# EAGLE design G1Tech PowerRelayMOV_v08 (EAGLE 9.3.1)
CNAME: G1Tech-Power-Relay-MOV; CREVISION: C; DESIGNER: G1Tech
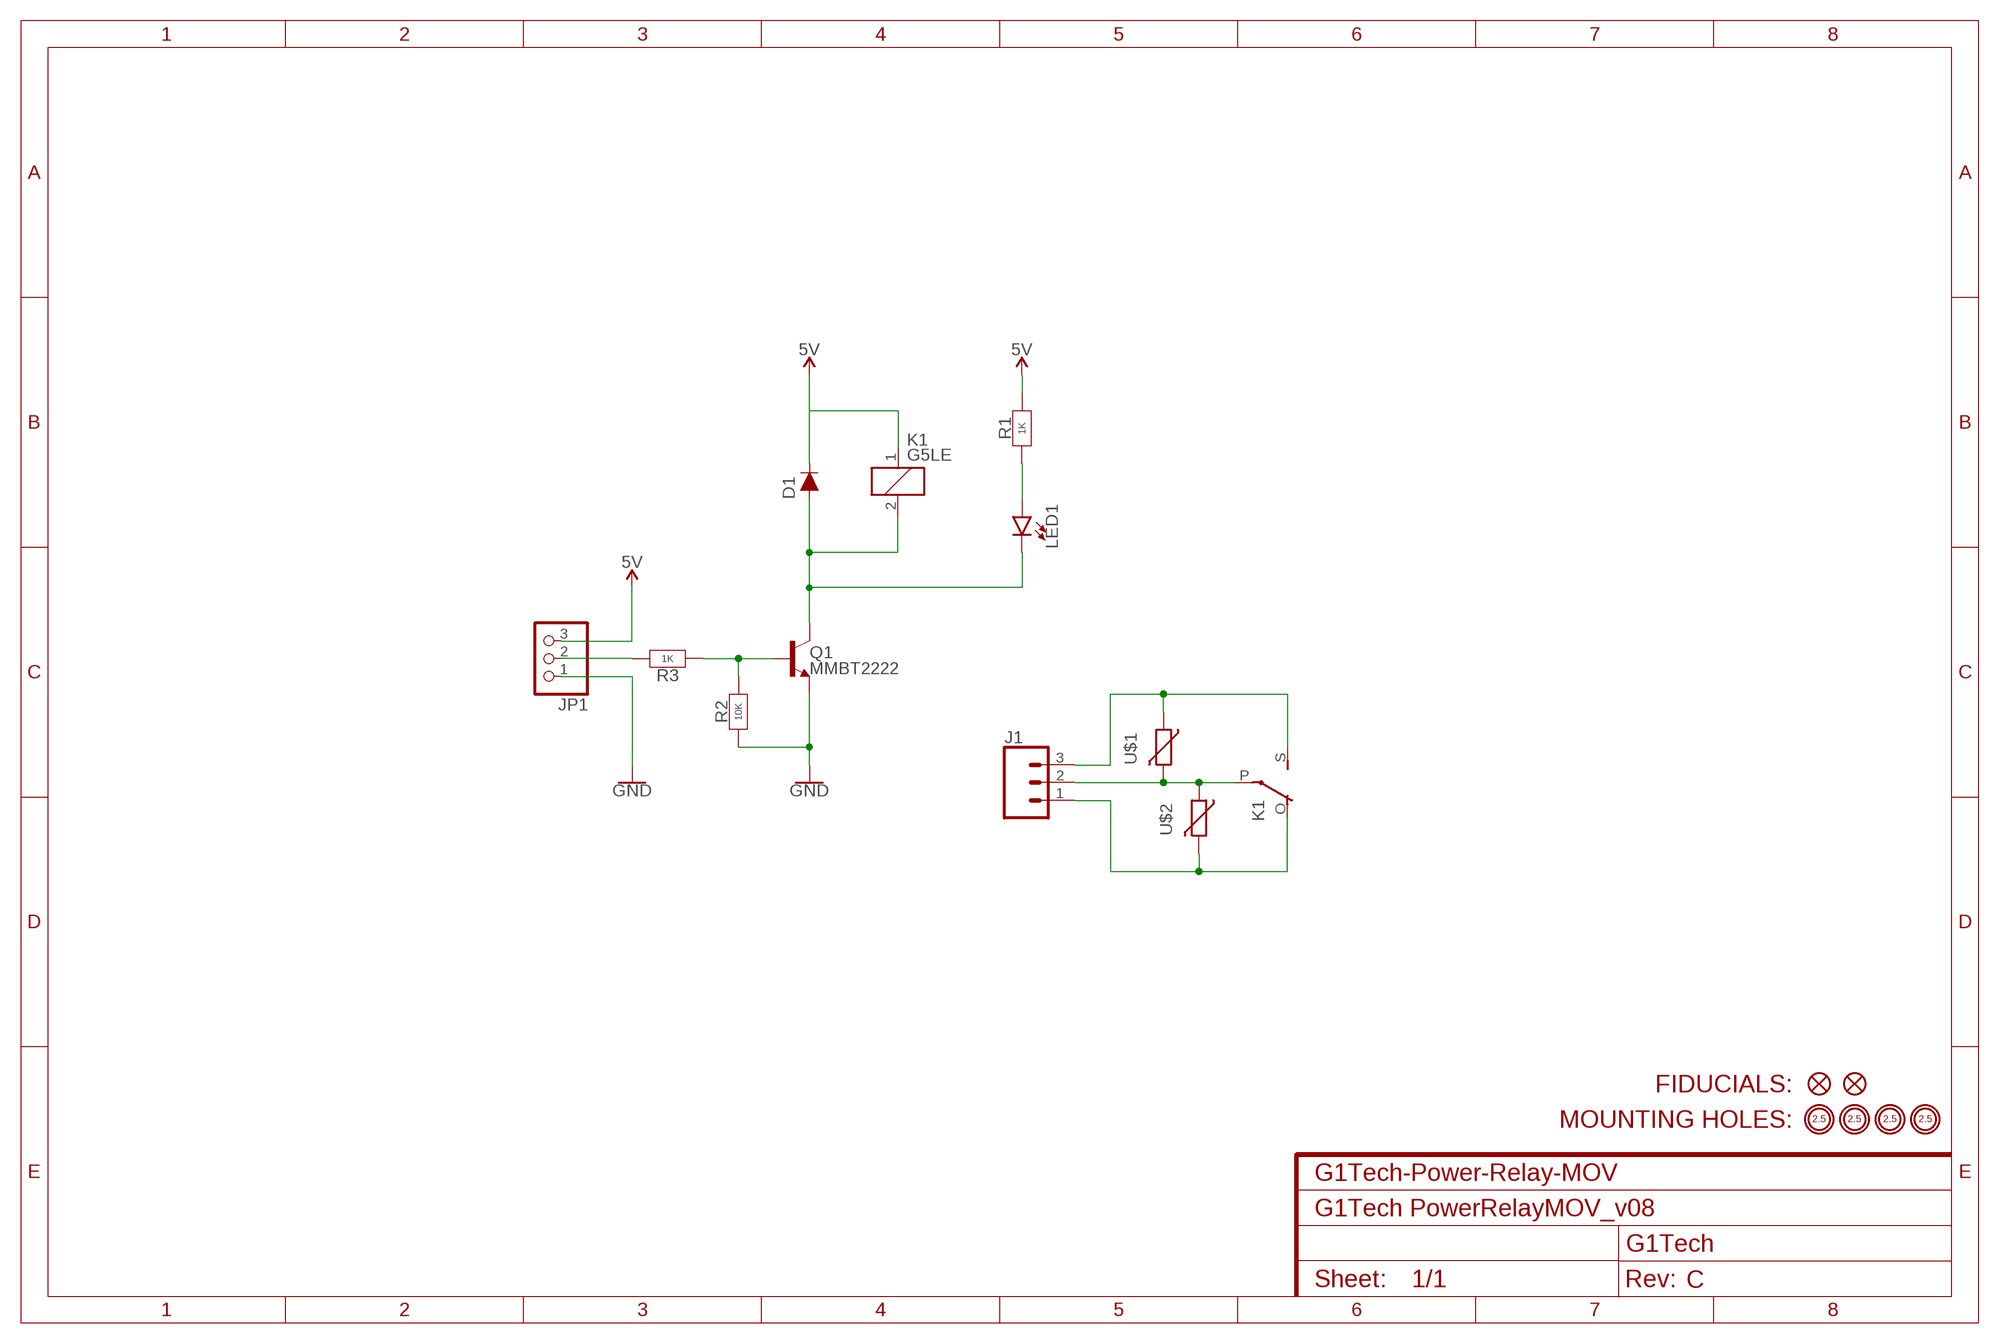
[diagram p0: schematic, sheet 1]

## Parts
D1  DIODE-1N4148W  [SOD123]
FD1  FIDUCIAL-1X2  [FIDUCIAL-1X2]
FD2  FIDUCIAL-1X2  [FIDUCIAL-1X2]
H1  MOUNTINGHOLE-PLATED-2.5  [MOUNTINGHOLE-PLATED-2.5]
H2  MOUNTINGHOLE-PLATED-2.5  [MOUNTINGHOLE-PLATED-2.5]
H3  MOUNTINGHOLE-PLATED-2.5  [MOUNTINGHOLE-PLATED-2.5]
H4  MOUNTINGHOLE-PLATED-2.5  [MOUNTINGHOLE-PLATED-2.5]
J1  CONN_03-SCREW-5MM  [SCREWTERMINAL-5MM-3]
JP1  PINHD-1X3  [1X03]
K1  G5LE  [G5LE]
LED1  LED0805  [LED0805]
Q1  MMBT2222  TRANS-NPN-MMBT2222  [SOT23-3]
R1  1K  YAGEO-R0603  [YAGEO-R0603]
R2  10K  YAGEO-R0603  [YAGEO-R0603]
R3  1K  YAGEO-R0603  [YAGEO-R0603]
U$1  MOV-V250LA4P  [V250LA4P]
U$2  MOV-V250LA4P  [V250LA4P]

## Nets
5V: D1.C JP1.3 K1.1 R1.2
GND: JP1.1 Q1.2(E) R2.1
N$1: D1.A K1.2 LED1.C Q1.3(C)
N$2: LED1.A R1.1
N$3: Q1.1(B) R2.2 R3.1
N$4: JP1.2 R3.2
N$5: J1.2 K1.P(2:P) U$1.P$2 U$2.P$1
N$6: J1.3 K1.S(2:S) U$1.P$1
N$7: J1.1 K1.O(2:O) U$2.P$2

## Library data of the parts
D1 = G1Tech-DiscreteSemi:DIODE-1N4148W
FD1 FD2 = G1Tech-Design:FIDUCIAL-1X2
H1-H4 = G1Tech-Design:MOUNTINGHOLE-PLATED-2.5
J1 = SparkFun-Connectors:CONN_03: Multi connection point. Often used as Generic Header-pin footprint for 0.1 inch spaced/style header connections On any of the 0.1 inch spaced packages, you can populate with these: Break Away Headers - Straight <https://www.sparkfun.com/products/116> (PRT-00116) Break Away Male Headers - Right Angle <https://www.sparkfun.com/products/553> (PRT-00553) Female Headers <https://www.sparkfun.com/products/115> (PRT-00115) Break Away Headers - Machine Pin <https://www.sparkfun.com/products/117> (PRT-00117) Break Away Female Headers - Swiss Machine Pin <https://www.sparkfun.com/products/743> (PRT-00743) Stackable Header - 3 Pin (Female, 0.1") <https://www.sparkfun.com/products/13875> (PRT-13875) For SCREWTERMINALS and SPRING TERMINALS visit here: Screw Terimnals on SparkFun.com <https://www.sparkfun.com/search/results?term=Screw+Terminals> (5mm/3.5mm/2.54mm spacing) This device is also useful as a general connection point to wire up your design to another part of your project. Our various solder wires solder well into these plated through hole pads. Hook-Up Wire - Assortment (Stranded, 22 AWG) <https://www.sparkfun.com/products/11375> (PRT-11375) Hook-Up Wire - Assortment (Solid Core, 22 AWG) <https://www.sparkfun.com/products/11367> (PRT-11367) View the entire wire category on our website here <https://www.sparkfun.com/categories/141> Special notes: Molex polarized connector foot print use with SKU : PRT-08232 with associated crimp pins and housings.; PROD_ID: CONN-10134; SF_SKU: PRT-08433
JP1 = adafruit:PINHD-1X3: PIN HEADER
K1 = relay:G5LE: RELAY 1 x switch, 10 A/120 V AC, 8 A/30 V DC, Omron; OC_FARNELL: unknown; OC_NEWARK: unknown
LED1 = G1Tech-LED:LED0805
Q1 = G1Tech-DiscreteSemi:TRANS-NPN-MMBT2222
R1-R3 = G1Tech-Resistors:YAGEO-R0603: YAGEO Resistor R0603
U$1 U$2 = G1Tech-CircuitProtection:MOV-V250LA4P

## Board
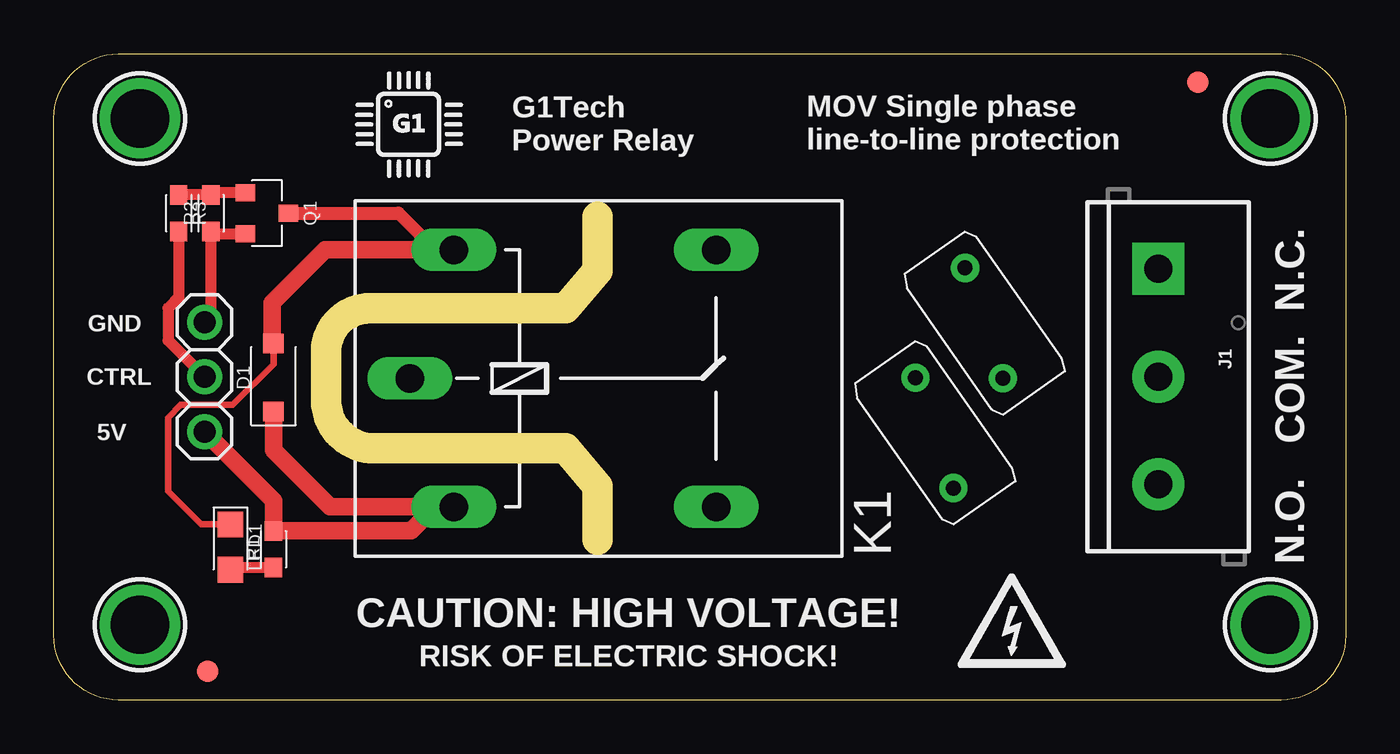
[diagram p1: board, top side]
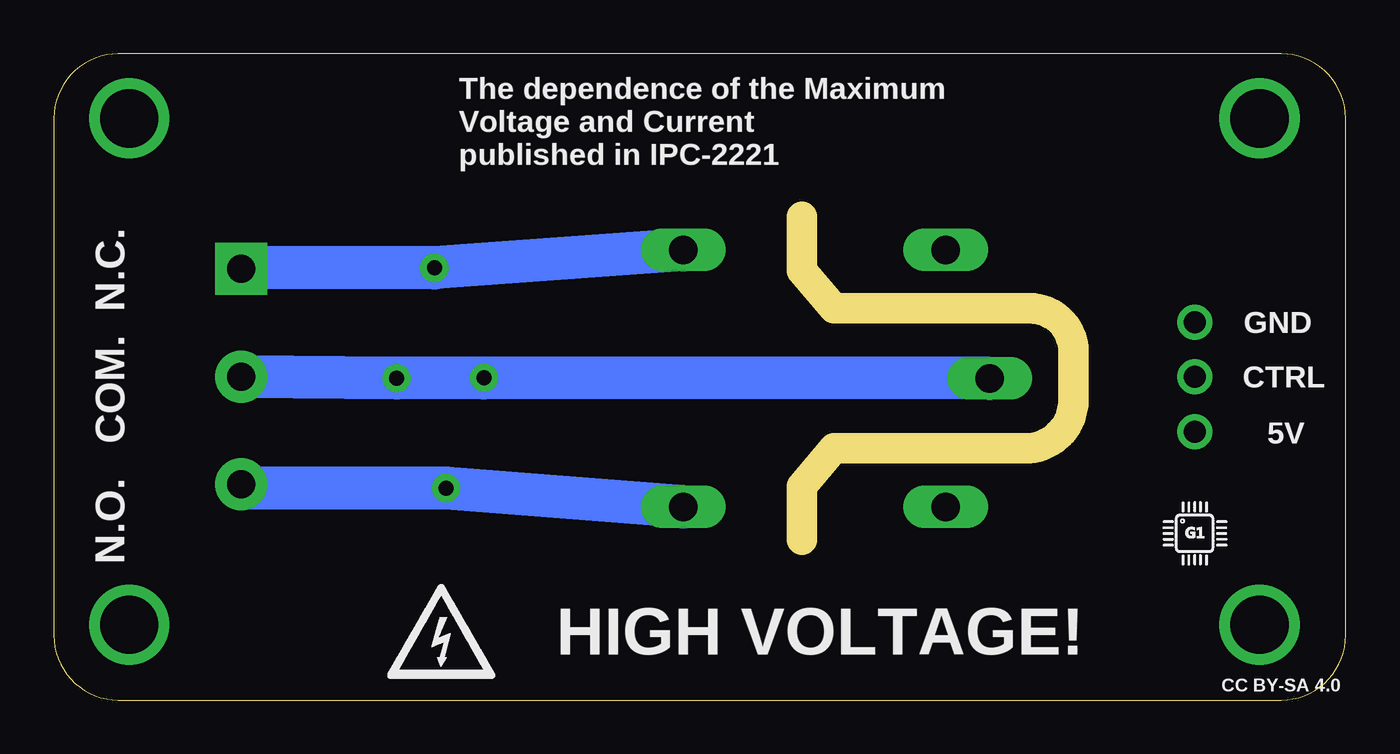
[diagram p2: board, bottom side, seen from below]

Size 60 x 30 mm. Coordinates in mm from the lower left corner, seen from the top.
Outline: 0,3 0,27 arc-90 3,30 57,30 arc-90 60,27 60,3 arc-90 57,0 3,0 arc-90 0,3
Copper layers (1*16): Top 0.035mm / dielectric 1.5mm / Bottom 0.035mm
Design rules "SparkFun": minimum track width 8mil, minimum drill 20mil, track to track 8mil, track to pad 8mil, pad to pad 8mil, via to via 8mil, smd to smd 8mil, copper to edge 9mil, drill to drill 8mil, minimum pad ring 12mil, minimum via ring 10mil, stop-mask expansion 4mil, vias tented up to drill 20mil, thermal gap 10mil
Milling: 9 lines

### Footprints (pad centres in the part's own frame; a part is rotated, then mirrored left to right if it is on the bottom)
SOD123 = smd 0.9 x 0.95: A 1.575,0; C -1.575,0
FIDUCIAL-1X2 = smd 1 x 1: 1 0,0
MOUNTINGHOLE-PLATED-2.5 = drill 2.7: P$1 0,0
SCREWTERMINAL-5MM-3 = drill 1.3 pad 2.413 square: 1 0,0 | drill 1.3 pad 2.413: 2 5,0; 3 10,0
1X03 = drill 1.016: 1 -2.54,0; 2 0,0; 3 2.54,0
G5LE = drill 1.321 long: 1 -7.493,-5.969; 2 -7.493,5.969; O 4.699,5.969; P -9.525,0; S 4.699,-5.969
LED0805 = smd 1.2 x 1.2: A 1.05,0; C -1.05,0
SOT23-3 = smd 0.8 x 0.9: 1 -0.95,-1; 2 0.95,-1; 3 0,1
YAGEO-R0603 = smd 0.9 x 0.8: 1 -0.85,0; 2 0.85,0
V250LA4P = drill 0.7: P$1 2.6,-0.75; P$2 -2.6,0.75

### Placement (x,y rotation side)
D1  10.21,14.97 90 top
FD1  7.14,1.33 0 top
FD2  53.14,28.68 0 top
H1  4,27 0 top
H2  4,3.5 0 top
H3  56.5,27 0 top
H4  56.5,3.5 0 top
J1  51.31,20.01 270 top
JP1  7,15 270 top
K1  26.07,14.93 0 top
LED1  8.2,7.1 270 top
Q1  9.9,22.6 270 top
R1  10.2,7 90 top
R2  7.3,22.6 90 top
R3  5.8,22.6 270 top
U$1  40.9,12.4 305 top
U$2  43.2,17.5 305 top
U$5  [G1TECH-LOGO-5MM]  14,24.25 0 top
U$7  [LOGO-HIGH-VOLTAGE-5MM]  44.5,1 0 bottom
U$8  [LOGO-HIGH-VOLTAGE-5MM]  42,1.5 0 top
U$9  [LOGO-G1TECH-3MM]  8.5,6.25 0 bottom

### Tracks (layer width: path | path; a pad name or v marks a point on that pad's centre or on a via)
5V
  Top 0.813: D1.C 10.21,11.59 12.84,8.96 17.7,8.96 | JP1.3 10.2,9.26 R1.2 16.59,7.85 17.7,8.96 | 17.7,8.96 K1.1
GND
  Top 0.508: JP1.1 7.3,17.84 R2.1 7.4,21.65 Q1.2
N$1
  Top 0.305: LED1.C 6.85,8.15 5.3,9.7 5.3,13.1 5.9,13.7 8.3,13.7 10.2,15.6 D1.A 10.14,16.61
  Top 0.61: K1.2 17.7,20.9 16,22.6 Q1.3 | 10.14,16.61 D1.A
  Top 0.813: 17.7,20.9 12.59,20.9 10.14,18.45 10.14,16.61
N$2
  Top 0.3: 8.43,6.28 LED1.A
  Top 0.508: R1.1 8.3,6.15 LED1.A
N$3
  Top 0.508: Q1.1 7.4,23.55 R2.2 R3.1
N$4
  Top 0.508: R3.2 5.8,18.7 5.3,18.2 5.3,16.7 JP1.2
N$5
  Bottom 2: K1.P U$1.P$2 U$2.P$1 J1.2
N$6
  Bottom 1.8: 51.13,9.84 J1.3
  Bottom 2: 51.13,9.84 U$1.P$1 K1.S
N$7
  Bottom 1.8: 51.26,20.06 J1.1
  Bottom 2: 51.26,20.06 U$2.P$2 K1.O

### Text on the board
tPlace: G1Tech / Power Relay | MOV Single phase / line-to-line protection | N.O. COM. N.C. | GND | CTRL | 5V | CAUTION: HIGH VOLTAGE! | RISK OF ELECTRIC SHOCK!
bPlace: The dependence of the Maximum / Voltage and Current / published in IPC-2221 | N.O. COM. N.C. | GND | CTRL | 5V | HIGH VOLTAGE! | CC BY-SA 4.0